# Altium schematic sheet 103091_B0.SchDoc: Voltage Regulator Board
size A4; Date: 2/20/2019; Author: TCM; CompanyName: Detex; Engineer: TCM; Organization: Detex Corp; Address2: 302 Detex Dr; Address3: New Braunfels, TX 78130; Address4: (830) 629-2900; DocumentNumber: 103091; Revision: B0; SheetNumber: 1; SheetTotal: 1; Time: 12:30 PM; DocumentName: main.SCHDOC
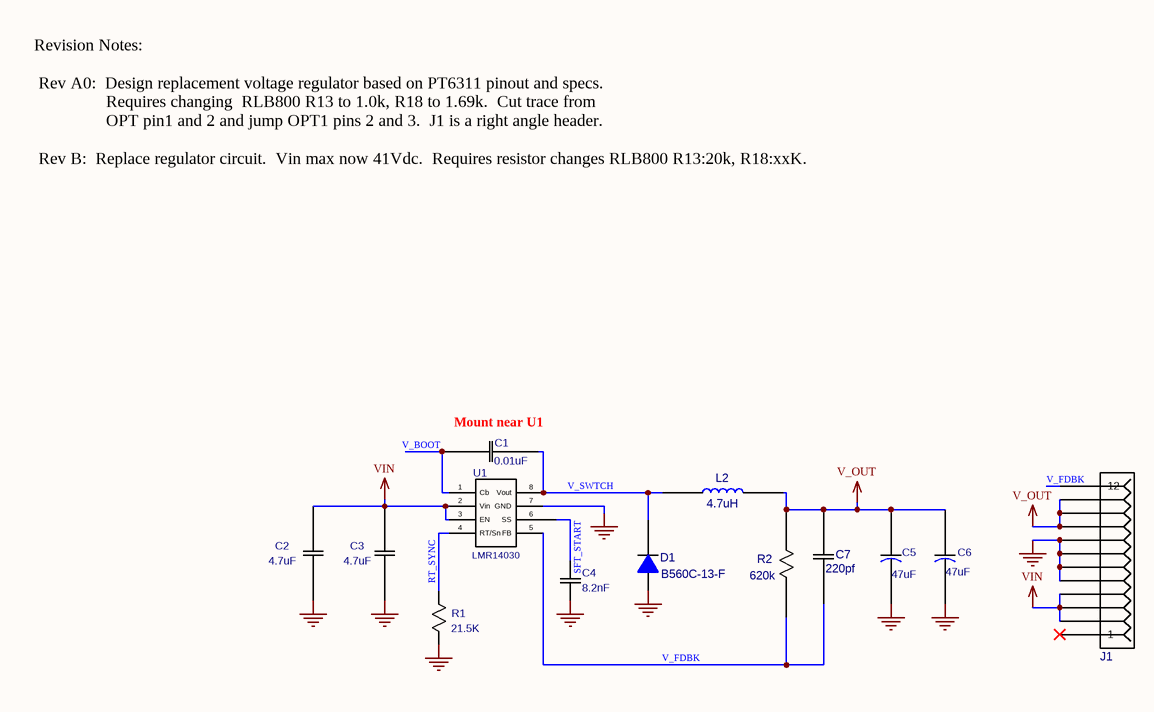
[diagram p0: 103091_B0.SchDoc]

## Parts
C1  value 0.01uF  [CC1206]  (hidden comment: CC1206_NP)
C2  value 4.7uF  [RES_0805]  (hidden comment: CAP_0805)
C3  value 4.7uF  [RES_0805]  (hidden comment: CAP_0805)
C4  value 8.2nF  [RES_0805]  (hidden comment: CAP_0805)
C5  value 47uF  [CAP_SMT_10X12]  (hidden comment: CAP_SMT_10X12)
C6  value 47uF  [CAP_SMT_10X12]  (hidden comment: CAP_SMT_10X12)
C7  value 220pf  [RES_0805]  (hidden comment: CAP_0805)
D1  MFR P/N: B560C-13-F  [SMC]  (hidden comment: SMC)
J1  HDR_100SP_12C  [HDR_12CR_100SP]  (value not drawn)
L2  value 4.7uH  [IND_SMT_XAL50]  (hidden comment: IND_SMT_XAL50)
R1  value 21.5K  [RES_1206]  (hidden comment: RES_1206)
R2  value 620k  [RES_1206]  (hidden comment: RES_1206)
U1  LMR14030  [LMR14030]

## Nets
GNDD: C2.2 C3.2 C4.1 C5.1 C6.1 D1.1(A) J1.5 J1.6 J1.7 J1.8 R1.2 U1.7(GND)
V_OUT: C5.2 C6.2 C7.1 J1.9 J1.10 J1.11 L2.1 R2.1
VIN: C2.1 C3.1 J1.2 J1.3 J1.4 U1.2(Vin) U1.3(EN)
RT_SYNC: R1.1 U1.4(RT/Sn)
SFT_START: C4.2 U1.6(SS)
V_BOOT: C1.A U1.1(Cb)
V_FDBK: C7.2 J1.12 R2.2 U1.5(FB)
V_SWTCH: C1.B D1.2(K) L2.2 U1.8(Vout)

Not connected (* = marked no-connect by the designer): J1 1*

## Notes on the sheet
- Revision Notes:
  Rev A0:  Design replacement voltage regulator based on PT6311 pinout and specs.
  Requires changing  RLB800 R13 to 1.0k, R18 to 1.69k.  Cut trace from
  OPT pin1 and 2 and jump OPT1 pins 2 and 3.  J1 is a right angle header.
  Rev B:  Replace regulator circuit.  Vin max now 41Vdc.  Requires resistor changes RLB800 R13:20k, R18:xxK.
- (near C1) Mount near U1
- Title
- Size:
- Date:
- A4
- Number:
- Time:
- Revision:
- Sheet
- of
- File:

## Library data of the parts
C3 = CAP_0805_VARIANT_1
D1 = SMC: Datasheet: https://www.diodes.com/assets/Datasheets/ds13012.pdf; Supplier 1: Mouser; Supplier Part Number 1: 621-B560C-F
J1 = HDR_100SP_12C: Value: *
U1 = LMR14030: Datasheet: https://www.ti.com/lit/ds/symlink/lmr14030.pdf; Supplier 1: Mouser; Supplier Part Number 1: 595-LMR14030SDDA; Supplier 2: Avnet; Supplier Part Number 2: LMR14030SDDA